# Altium schematic sheet 4_NTC_Sample.schdoc
size 297 x 209 mm; Symbol: sucaimuban; Company: 嘉立创EDA; Version: V1.0; Page Size: A4; @Project Name: 26gsSucaiku; @Update Date: 2026-06-26; @Create Date: 2026-06-21; Device: sucaimuban; @Board Name: Sucaiku; @Page Name: NTC_Sample; @Create Time: 21:33:36; @Page Count: 7; @Page No: 4; @Schematic Name: Schematic1; @Update Time: 14:44:06; @Assembly Variant: Basic; Border: 1; Title Block Position: 3; Size: A4; Width: 1170; Height: 825; Region Start: 1; X Region Count: 6; Y Region Count: 4; Blade Width: 10
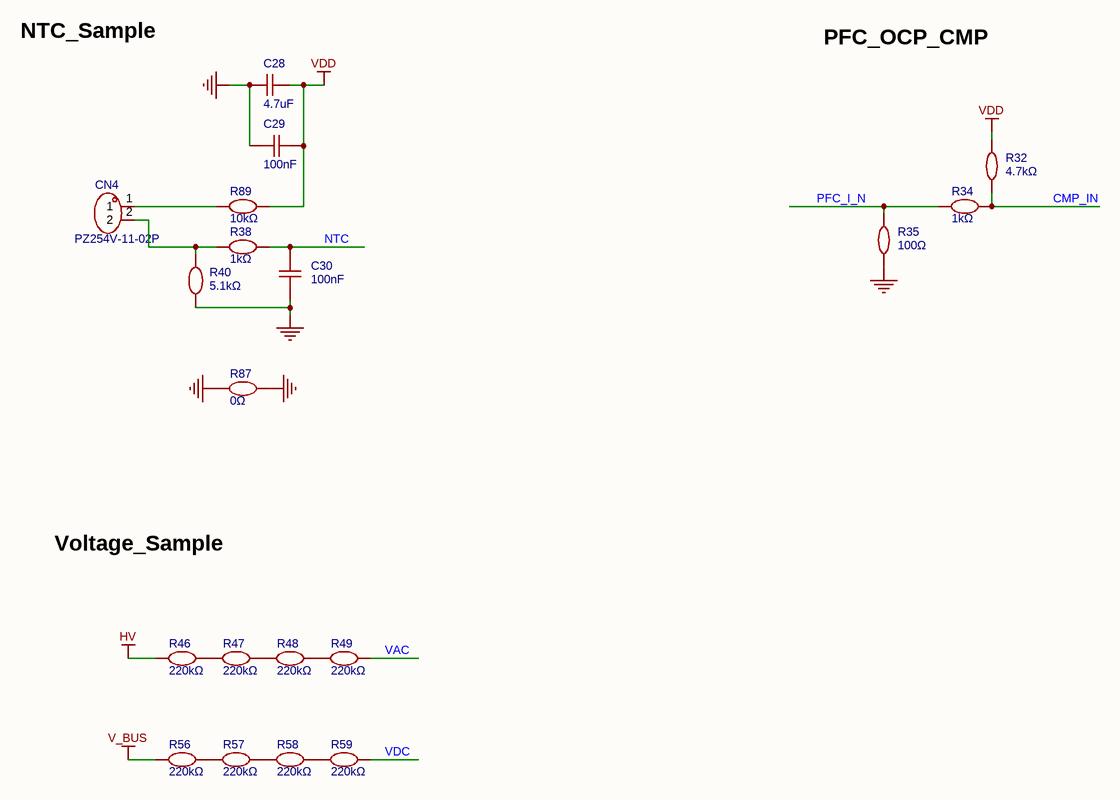
[diagram p0: 4_NTC_Sample.schdoc]

## Parts
C28  4.7uF  [C1206]
C29  100nF  [C0603]
C30  100nF  [C0603]
CN4  PZ254V-11-02P  [HDR-TH_2P-P2.54-V-M]
R32  4.7kΩ  [R0603]
R34  1kΩ  [R0603]
R35  100Ω  [R0603]
R38  1kΩ  [R0603]
R40  5.1kΩ  [R0603]
R46  220kΩ  [R1206]
R47  220kΩ  [R1206]
R48  220kΩ  [R1206]
R49  220kΩ  [R1206]
R56  220kΩ  [R1206]
R57  220kΩ  [R1206]
R58  220kΩ  [R1206]
R59  220kΩ  [R1206]
R87  0Ω  [R1206]
R89  10kΩ  [R0603]

## Nets
GND: C28.2 C29.1 C30.1 R35.1 R40.1 R87.1 R87.2
HV: R46.1
V_BUS: R56.1
VDD: C28.1 C29.2 R32.2 R89.1
CMP_IN: R32.1 R34.1
NTC: C30.2 R38.1
PFC_I_N: R34.2 R35.2
VAC: R49.2
VDC: R59.2
NetCN4_1: CN4.1 R89.2
NetCN4_2: CN4.2 R38.2 R40.2
NetR46_2: R46.2 R47.1
NetR47_2: R47.2 R48.1
NetR48_2: R48.2 R49.1
NetR56_2: R56.2 R57.1
NetR57_2: R57.2 R58.1
NetR58_2: R58.2 R59.1

## Notes on the sheet
- NTC_Sample
- PFC_OCP_CMP
- Voltage_Sample
- 身份证号
- 选手姓名
- 手 机 号
- 图页名称
- 第                      幅
- 工程名称
- 共                    幅
- 当前日期
- 当前时间

## Library data of the parts
C28 = CL31A475KAHNNNE: 容值:4.7uF;精度:±10%;额定电压:25V;温度系数:X5R;; Manufacturer: SAMSUNG(三星); AddInBom: yes; ModelId: e4be705b945545a48e666415e3682bd8聨0819f05c4eef4c71ace90d822a990e87; ModelName: C1206_L3.2-W1.6-H1.3; ModelTransform: 125.984,62.992,0,0,0,0,0,0,0; Tolerance: ±10%; Voltage Rating: 25V; Temperature Coefficient: X5R; Symbol: CL31A475KAHNNNE; Device: CL31A475KAHNNNE; LCSC Part Name: 4.7uF ±10% 25V; SupplierPart: C11044; ManufacturerPart: CL31A475KAHNNNE; Supplier Footprint: 1206; JLCPCB Part Class: Extended Part; Datasheet: https://item.szlcsc.com/datasheet/CL31A475KAHNNNE/11591.html; Supplier: LCSC; ConvertToPcb: yes; FootprintName: C1206; Value: 4.7uF
C29 C30 = CL10B104KB8NNNC: 容值:100nF;精度:±10%;额定电压:50V;温度系数:X7R;; Manufacturer: SAMSUNG(三星); AddInBom: yes; ModelId: ac125912035d415993ca9572d50418b1聨0819f05c4eef4c71ace90d822a990e87; ModelName: C0603_L1.6-W0.8-H0.8; ModelTransform: 62.992,31.496,0,0,0,0,0,0,0; Tolerance: ±10%; Voltage Rating: 50V; Temperature Coefficient: X7R; Symbol: CL10B104KB8NNNC; Device: CL10B104KB8NNNC; LCSC Part Name: 100nF ±10% 50V; SupplierPart: C1591; ManufacturerPart: CL10B104KB8NNNC; Supplier Footprint: 0603; JLCPCB Part Class: Extended Part; Datasheet: https://item.szlcsc.com/datasheet/CL10B104KB8NNNC/1943.html; Supplier: LCSC; ConvertToPcb: yes; FootprintName: C0603; Value: 100nF
CN4 = PZ254V-11-02P: 插针结构:1x2P;间距:2.54mm;行距:-;圆针/方针:方针;安装方式:直插;排数:单排;总PIN位数:2P;额定电流:3A;额定电压:250V;配合针长度:6mm;塑高:2.5mm;端接针长度:3mm;触头材质:黄铜;触头镀层:-;工作温度:-40℃~+105℃;颜色:黑色;; Manufacturer: XFCN(兴飞); AddInBom: yes; ModelId: e35305ec3aa84b66b849f914b715e73f聨0819f05c4eef4c71ace90d822a990e87; ModelName: HDR2.54-M-LI-1X2P; ModelTransform: 200,100,0,0,0,0,0,0,-118.11; Pin Structure: 1x2P; Pitch: 2.54mm; Circluar Pins/Square Pins: 方针; Current Rating: 3A; Voltage Rating (Max): 250V; Symbol: PZ254V-11-02P; Device: PZ254V-11-02P; LCSC Part Name: 1x2P 间距:2.54mm 方针 直插; SupplierPart: C492401; ManufacturerPart: PZ254V-11-02P; Supplier Footprint: 插件,P=2.54mm; JLCPCB Part Class: Extended Part; Datasheet: https://item.szlcsc.com/datasheet/PZ254V-11-02P/502957.html; Supplier: LCSC; ConvertToPcb: yes; FootprintName: HDR-TH_2P-P2.54-V-M; Row Spacing: -; Mounting Type: 直插; Number of Rows: 单排; Number of Pins: 2P; Length of Mating Pin: 6mm; Insulation Height: 2.5mm; Length of End Connection Pin: 3mm; Contact Material: 黄铜; Contact Plating: -; Operating Temperature: -40℃~+105℃; Color: 黑色
R32 = 0603WAF4701T5E: 电阻类型:厚膜电阻;阻值:4.7kΩ;精度:±1%;功率:100mW;工作电压:75V;温度系数:±100ppm/℃;; Manufacturer: UNI-ROYAL(厚声); AddInBom: yes; ModelId: fc143cca1e79419f9cd78b61e9279f08聨0819f05c4eef4c71ace90d822a990e87; ModelTransform: 31.8897,63.7794,0,90,0,0,0,0,0; Tolerance: ±1%; Power(Watts): 100mW; Voltage-Supply(Max): 75V; Symbol: 0603WAF4701T5E; Device: 0603WAF4701T5E; LCSC Part Name: 4.7kΩ ±1% 100mW 厚膜电阻; SupplierPart: C23162; ManufacturerPart: 0603WAF4701T5E; Supplier Footprint: 0603; JLCPCB Part Class: Basic Part; Datasheet: https://item.szlcsc.com/datasheet/0603WAF4701T5E/23889.html; Supplier: LCSC; ConvertToPcb: yes; FootprintName: R0603; ModelName: R0603; Type: 厚膜电阻; Value: 4.7kΩ; Temperature Coefficient: ±100ppm/℃; Operating Temperature: -55℃~+155℃
R34 R38 = AST031KF: 阻值:1kΩ;精度:±1%;功率:100mW;工作电压:75V;温度系数:±100ppm/℃;; Manufacturer: HKR(香港电阻); 3D Model: fc143cca1e79419f9cd78b61e9279f08聨0819f05c4eef4c71ace90d822a990e87; 3D Model Transform: 31.8897,63.7794,0,90,0,0,0,0,0; Tolerance: ±1%; Power(Watts): 100mW; Voltage-Supply(Max): 75V; AddInBom: yes; Symbol: AST031KF; Device: AST031KF; LCSC Part Name: 1K ±1%; Supplier Part: C49330120; Manufacturer Part: AST031KF; Supplier Footprint: 0603; JLCPCB Part Class: Extended Part; Datasheet: https://item.szlcsc.com/datasheet/AST031KF/51811762.html; Supplier: LCSC; Value: 1kΩ; Temperature Coefficient: ±100ppm/℃; Operating Temperature: -55℃~+155℃; ConvertToPcb: yes; FootprintName: R0603; ModelName: R0603
R35 = RC0603FR-07100RL: 电阻类型:厚膜电阻;阻值:100Ω;精度:±1%;功率:100mW;最大工作电压:75V;温度系数:±100ppm/℃;; Manufacturer: YAGEO(国巨); AddInBom: yes; ModelId: fc143cca1e79419f9cd78b61e9279f08聨0819f05c4eef4c71ace90d822a990e87; ModelTransform: 31.8897,63.7794,0,90,0,0,0,0,0; Tolerance: ±1%; Power(Watts): 100mW; Overload Voltage (Max): 75V; Symbol: RC0603FR-07100RL; Device: RC0603FR-07100RL; LCSC Part Name: 厚膜电阻 100Ω ±1% 100mW; SupplierPart: C105588; ManufacturerPart: RC0603FR-07100RL; Supplier Footprint: 0603; JLCPCB Part Class: Extended Part; Datasheet: https://atta.szlcsc.com/upload/public/pdf/source/20180316/70C0E2BDAE7FCC62C531A5A58D202EE1.pdf; Supplier: LCSC; ConvertToPcb: yes; FootprintName: R0603; ModelName: R0603; Type: 厚膜电阻; Value: 100Ω; Temperature Coefficient: ±100ppm/℃; Operating Temperature Range: -55℃~+155℃
R40 = FRC0603F5101TS: 电阻类型:厚膜电阻;阻值:5.1kΩ;精度:±1%;功率:100mW;工作电压:75V;温度系数:±100ppm/℃;; Manufacturer: FOJAN(富捷); AddInBom: yes; ModelId: fc143cca1e79419f9cd78b61e9279f08聨0819f05c4eef4c71ace90d822a990e87; ModelTransform: 31.8897,63.7794,0,90,0,0,0,0,0; Tolerance: ±1%; Power(Watts): 100mW; Voltage-Supply(Max): 75V; Symbol: FRC0603F5101TS; Device: FRC0603F5101TS; LCSC Part Name: 5.1kΩ ±1% 100mW 厚膜电阻; SupplierPart: C2907044; ManufacturerPart: FRC0603F5101TS; Supplier Footprint: 0603; JLCPCB Part Class: Extended Part; Supplier: LCSC; ConvertToPcb: yes; FootprintName: R0603; ModelName: R0603; Type: 厚膜电阻; Value: 5.1kΩ; Temperature Coefficient: ±100ppm/℃; Operating Temperature: -55℃~+155℃
R46-R49 R56-R59 = GR1206F220KT5G00: 电阻类型:厚膜电阻;阻值:220kΩ;精度:±1%;功率:250mW;工作电压:200V;; Manufacturer: GiantOhm(鼎声微电); AddInBom: yes; ModelId: 89a1f13db2384da588040e0b3c55bf66聨0819f05c4eef4c71ace90d822a990e87; ModelName: R1206_L3.2-W1.6-H0.6; ModelTransform: 125.984,62.992,0,0,0,0,0,0,0; Tolerance: ±1%; Power(Watts): 250mW; Voltage-Supply(Max): 200V; Symbol: GR1206F220KT5G00; Device: GR1206F220KT5G00; LCSC Part Name: 220K ±1%; SupplierPart: C49653412; ManufacturerPart: GR1206F220KT5G00; Supplier Footprint: 1206; JLCPCB Part Class: Extended Part; Datasheet: https://item.szlcsc.com/datasheet/GR1206F220KT5G00/52210998.html; Supplier: LCSC; ConvertToPcb: yes; FootprintName: R1206; Type: 厚膜电阻; Value: 220kΩ; Operating Temperature: -55℃~+155℃
R87 = FRC1206P000 TS: 电阻类型:厚膜电阻;阻值:0Ω;精度:±5%;功率:250mW;工作电压:200V;; Manufacturer: FOJAN(富捷); AddInBom: yes; ModelId: 89a1f13db2384da588040e0b3c55bf66聨0819f05c4eef4c71ace90d822a990e87; ModelName: R1206_L3.2-W1.6-H0.6; ModelTransform: 125.984,62.992,0,0,0,0,0,0,0; Tolerance: ±5%; Power(Watts): 250mW; Voltage-Supply(Max): 200V; Symbol: FRC1206P000 TS; Device: FRC1206P000 TS; LCSC Part Name: 0Ω ±5% 250mW 厚膜电阻; SupplierPart: C2907406; ManufacturerPart: FRC1206P000 TS; Supplier Footprint: 1206; JLCPCB Part Class: Extended Part; Supplier: LCSC; ConvertToPcb: yes; FootprintName: R1206; Type: 厚膜电阻; Value: 0Ω; Operating Temperature: -55℃~+155℃
R89 = AST0310KF: 阻值:10kΩ;精度:±1%;功率:100mW;工作电压:75V;温度系数:±100ppm/℃;; Manufacturer: HKR(香港电阻); 3D Model: fc143cca1e79419f9cd78b61e9279f08聨0819f05c4eef4c71ace90d822a990e87; 3D Model Transform: 31.8897,63.7794,0,90,0,0,0,0,0; Tolerance: ±1%; Power(Watts): 100mW; Voltage-Supply(Max): 75V; AddInBom: yes; Symbol: AST0310KF; Device: AST0310KF; LCSC Part Name: 10K ±1%; Supplier Part: C49330116; Manufacturer Part: AST0310KF; Supplier Footprint: 0603; JLCPCB Part Class: Extended Part; Datasheet: https://item.szlcsc.com/datasheet/AST0310KF/51811758.html; Supplier: LCSC; Value: 10kΩ; Temperature Coefficient: ±100ppm/℃; Operating Temperature: -55℃~+155℃; ConvertToPcb: yes; FootprintName: R0603; ModelName: R0603